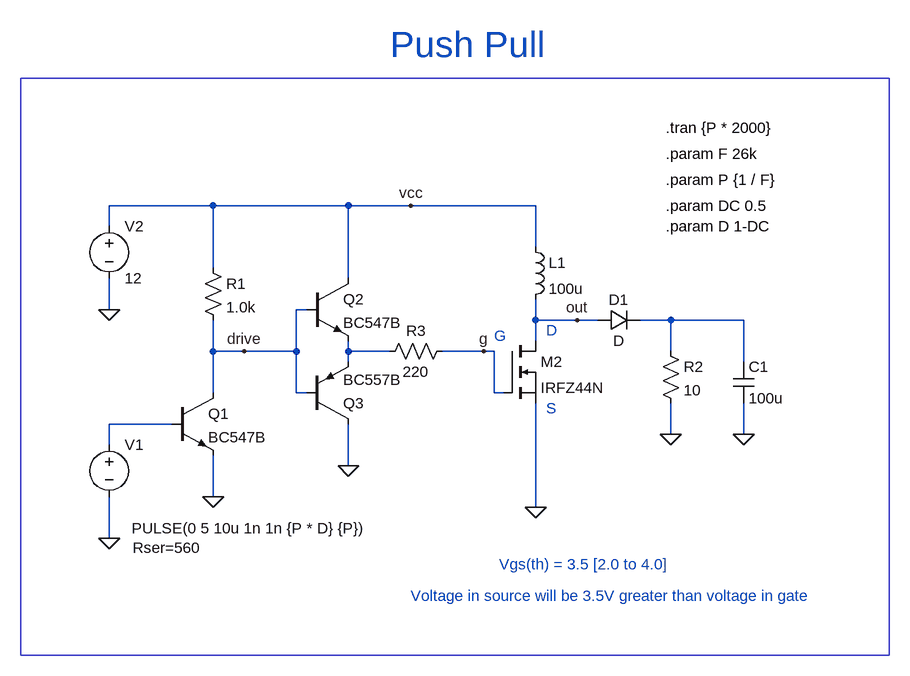
[diagram p0: schematic boost-converter-push-pull.asc]
boost-converter-push-pull.asc, the LTspice schematic file:
Version 4
SHEET 1 1044 1184
WIRE -64 -96 -224 -96
WIRE 144 -96 -64 -96
WIRE 240 -96 144 -96
WIRE 432 -96 240 -96
WIRE -224 -64 -224 -96
WIRE 432 -32 432 -96
WIRE -64 0 -64 -96
WIRE 144 16 144 -96
WIRE -224 64 -224 16
WIRE 80 64 64 64
WIRE 432 80 432 48
WIRE 496 80 432 80
WIRE 528 80 496 80
WIRE 640 80 592 80
WIRE 752 80 640 80
WIRE 432 112 432 80
WIRE -64 128 -64 80
WIRE -16 128 -64 128
WIRE 64 128 64 64
WIRE 64 128 -16 128
WIRE 144 128 144 112
WIRE 208 128 144 128
WIRE 352 128 288 128
WIRE 368 128 352 128
WIRE 640 128 640 80
WIRE 144 144 144 128
WIRE 752 144 752 80
WIRE -64 192 -64 128
WIRE 64 192 64 128
WIRE 80 192 64 192
WIRE 368 192 368 128
WIRE 384 192 368 192
WIRE -128 240 -224 240
WIRE 640 256 640 208
WIRE 752 256 752 208
WIRE -224 272 -224 240
WIRE 144 304 144 240
WIRE -64 352 -64 288
WIRE 432 368 432 208
WIRE -224 416 -224 352
FLAG 144 304 0
FLAG -224 416 0
FLAG -224 64 0
FLAG -64 352 0
FLAG 432 368 0
FLAG 496 80 out
FLAG 352 128 g
FLAG 752 256 0
FLAG 640 256 0
FLAG 240 -96 vcc
FLAG -16 128 drive
SYMBOL npn -128 192 R0
SYMATTR InstName Q1
SYMATTR Value BC547B
SYMBOL voltage -224 256 R0
WINDOW 3 35 144 Left 2
WINDOW 39 36 174 Left 2
SYMATTR Value PULSE(0 5 10u 1n 1n {P * D} {P})
SYMATTR SpiceLine Rser=560
SYMATTR InstName V1
SYMBOL voltage -224 -80 R0
WINDOW 39 24 38 Left 2
SYMATTR InstName V2
SYMATTR Value 12
SYMBOL res -80 -16 R0
SYMATTR InstName R1
SYMATTR Value 1.0k
SYMBOL npn 80 16 R0
SYMATTR InstName Q2
SYMATTR Value BC547B
SYMBOL pnp 80 240 M180
SYMATTR InstName Q3
SYMATTR Value BC557B
SYMBOL ind 416 -48 R0
SYMATTR InstName L1
SYMATTR Value 100u
SYMATTR SpiceLine Rser=.35
SYMBOL Res 624 112 R0
SYMATTR InstName R2
SYMATTR Value 10
SYMBOL Cap 736 144 R0
SYMATTR InstName C1
SYMATTR Value 100u
SYMBOL Diode 528 64 M90
WINDOW 0 0 32 VBottom 2
WINDOW 3 32 32 VTop 2
SYMATTR InstName D1
SYMBOL nmos 384 112 R0
SYMATTR InstName M2
SYMATTR Value IRFZ44N
SYMBOL Res 304 112 R90
WINDOW 0 0 56 VBottom 2
WINDOW 3 32 56 VTop 2
SYMATTR InstName R3
SYMATTR Value 220
TEXT 208 -344 Left 5 ;Push Pull
TEXT 632 -216 Left 2 !.tran {P * 2000}
TEXT 376 456 Left 2 ;Vgs(th) = 3.5 [2.0 to 4.0]
TEXT 240 504 Left 2 ;Voltage in source will be 3.5V greater than voltage in gate
TEXT 448 216 Left 2 ;S
TEXT 448 96 Left 2 ;D
TEXT 368 104 Left 2 ;G
TEXT 632 -176 Left 2 !.param F 26k
TEXT 632 -136 Left 2 !.param P {1 / F}
TEXT 632 -64 Left 2 !.param D 1-DC
TEXT 632 -96 Left 2 !.param DC 0.5
RECTANGLE Normal -360 -292 976 596

The netlist it stands for:
* boost-converter-push-pull.asc
Q1 drive N003 0 0 BC547B
V1 N003 0 PULSE(0 5 10u 1n 1n {P * D} {P}) Rser=560
V2 vcc 0 12
R1 vcc drive 1.0k
Q2 vcc drive N002 0 BC547B
Q3 0 drive N002 0 BC557B
L1 vcc out 100u Rser=.35
R2 N001 0 10
C1 N001 0 100u
D1 out N001 D
M2 out g 0 0 IRFZ44N
R3 g N002 220
.model D D
.lib standard.dio
.model NPN NPN
.model PNP PNP
.lib standard.bjt
.model NMOS NMOS
.model PMOS PMOS
.lib standard.mos
* Push Pull
.tran {P * 2000}
* Vgs(th) = 3.5 [2.0 to 4.0]
* Voltage in source will be 3.5V greater than voltage in gate
* S
* D
* G
.param F 26k
.param P {1 / F}
.param D 1-DC
.param DC 0.5
.backanno
.end